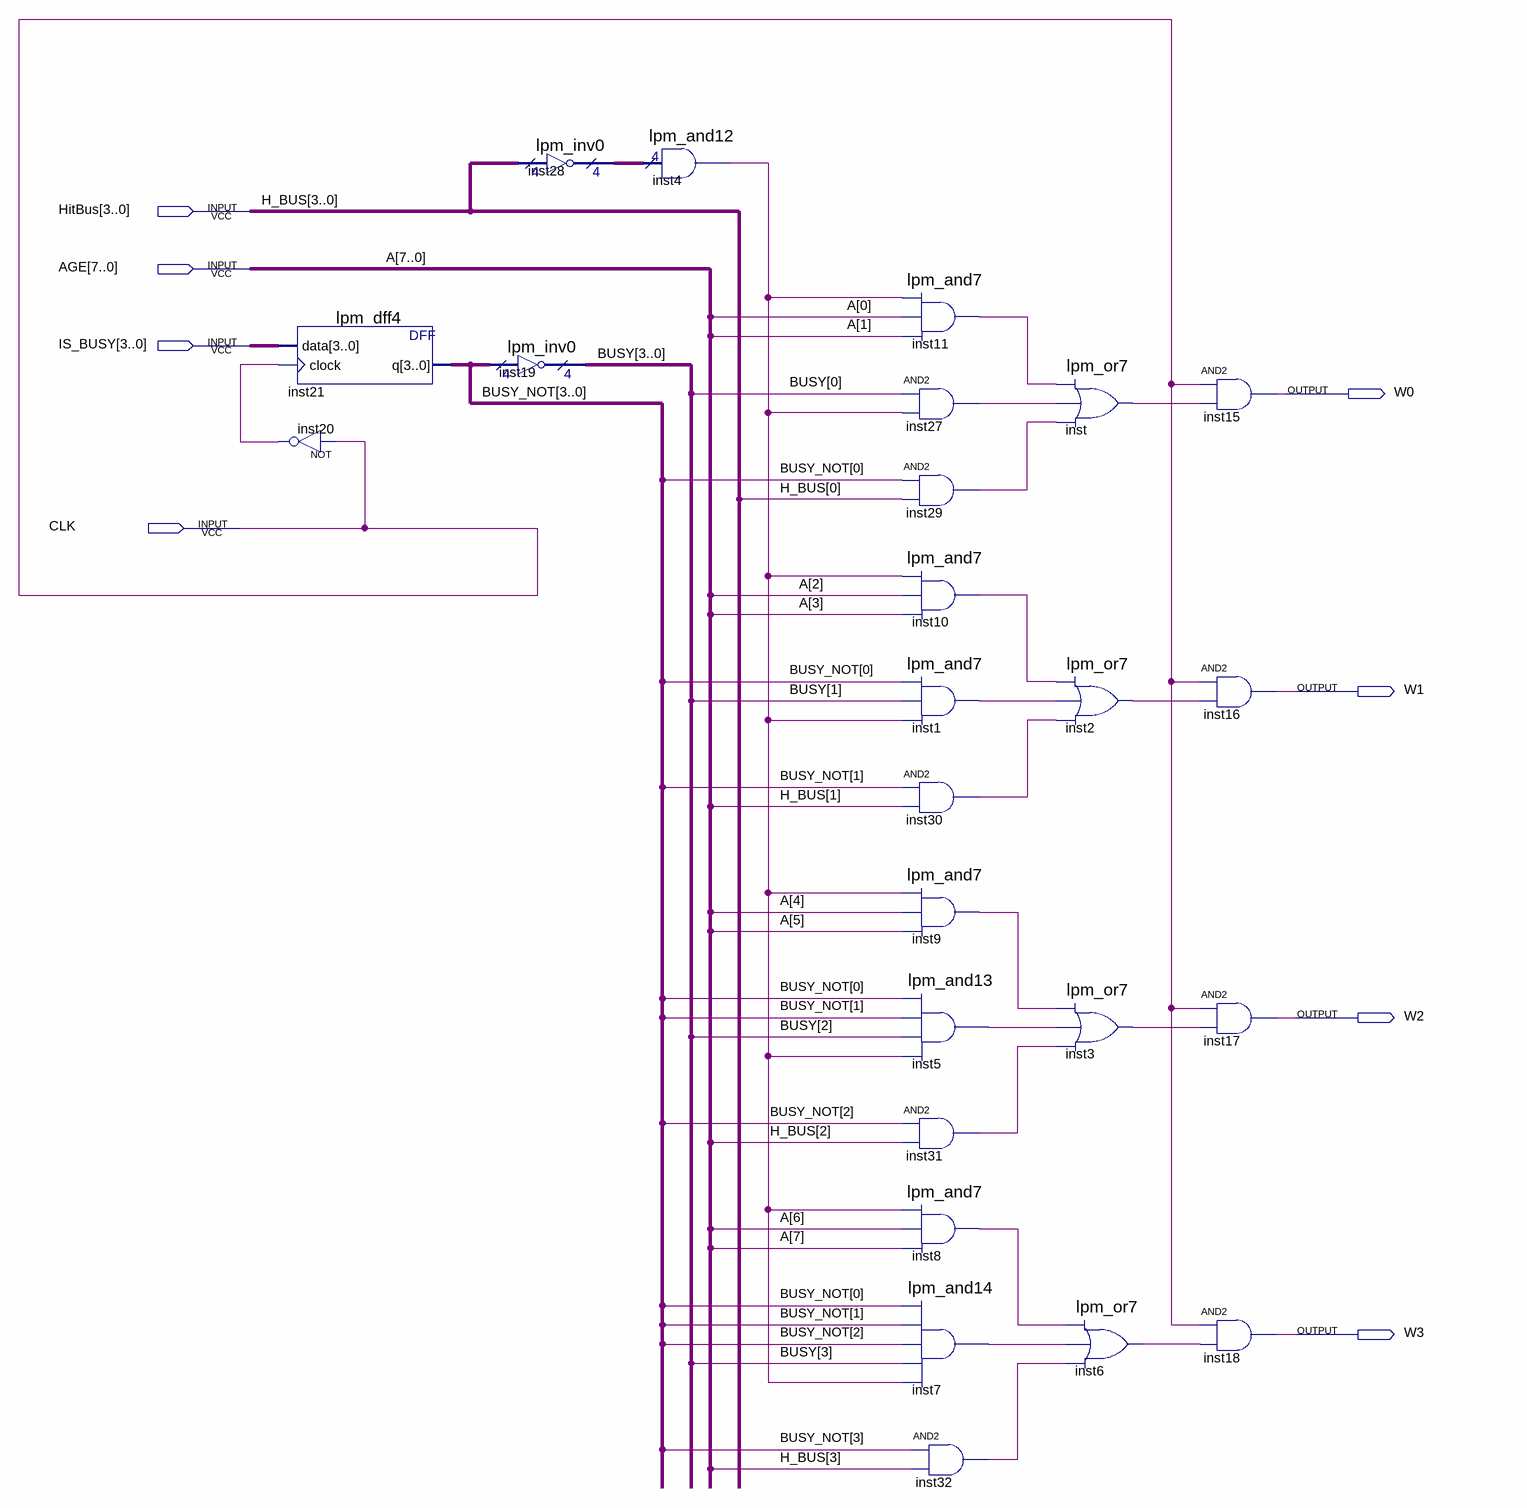
[diagram p0: schematic sheet]
// Quartus schematic Where_Write.bdf as structural Verilog: 25 symbols, 8 pins
module Where_Write (
  input  [3:0] HitBus,
  input  [7:0] AGE,
  input  [3:0] IS_BUSY,
  input  CLK,
  output W0,
  output W1,
  output W2,
  output W3
);

  wire inst1_result, inst2_result, inst3_result, inst4_result, inst5_result, inst6_result, inst7_result,
       inst8_result, inst9_result, inst10_result, inst11_result, inst20_out, inst27_out, inst29_out,
       inst30_out, inst31_out, inst32_out, inst_result;
  wire [3:0] BUSY, BUSY_NOT, inst28_result;

  lpm_dff4 inst21 (.data(IS_BUSY), .clock(inst20_out), .q(BUSY_NOT));
  not inst20 (inst20_out, CLK);
  lpm_inv0 inst28 (.data(HitBus), .result(inst28_result));
  lpm_inv0 inst19 (.data(BUSY_NOT), .result(BUSY));
  lpm_and12 inst4 (.data(inst28_result), .result(inst4_result));
  lpm_and7 inst11 (.data0(inst4_result), .data1(AGE[0]), .data2(AGE[1]), .result(inst11_result));
  and inst27 (inst27_out, BUSY[0], inst4_result);
  and inst29 (inst29_out, BUSY_NOT[0], HitBus[0]);
  lpm_and7 inst10 (.data0(inst4_result), .data1(AGE[2]), .data2(AGE[3]), .result(inst10_result));
  lpm_and7 inst1 (.data0(BUSY_NOT[0]), .data1(BUSY[1]), .data2(inst4_result), .result(inst1_result));
  and inst30 (inst30_out, BUSY_NOT[1], HitBus[1]);
  lpm_and7 inst9 (.data0(inst4_result), .data1(AGE[4]), .data2(AGE[5]), .result(inst9_result));
  lpm_and13 inst5 (
    .data0(BUSY_NOT[0]), .data1(BUSY_NOT[1]), .data2(BUSY[2]), .data3(inst4_result), .result(inst5_result));
  and inst31 (inst31_out, BUSY_NOT[2], HitBus[2]);
  lpm_and7 inst8 (.data0(inst4_result), .data1(AGE[6]), .data2(AGE[7]), .result(inst8_result));
  lpm_and14 inst7 (
    .data0(BUSY_NOT[0]), .data1(BUSY_NOT[1]), .data2(BUSY_NOT[2]), .data3(BUSY[3]), .data4(inst4_result),
    .result(inst7_result));
  and inst32 (inst32_out, BUSY_NOT[3], HitBus[3]);
  lpm_or7 inst (.data0(inst11_result), .data1(inst27_out), .data2(inst29_out), .result(inst_result));
  lpm_or7 inst2 (.data0(inst10_result), .data1(inst1_result), .data2(inst30_out), .result(inst2_result));
  lpm_or7 inst3 (.data0(inst9_result), .data1(inst5_result), .data2(inst31_out), .result(inst3_result));
  lpm_or7 inst6 (.data0(inst8_result), .data1(inst7_result), .data2(inst32_out), .result(inst6_result));
  and inst15 (W0, CLK, inst_result);
  and inst16 (W1, CLK, inst2_result);
  and inst17 (W2, CLK, inst3_result);
  and inst18 (W3, CLK, inst6_result);

  // Other names for the same wires on the sheet: A[7:0] = AGE; H_BUS[3:0] = HitBus
endmodule
